# EAGLE schematic registers2-4a (EAGLE 7.5.0)

## Sheet 1 of 2
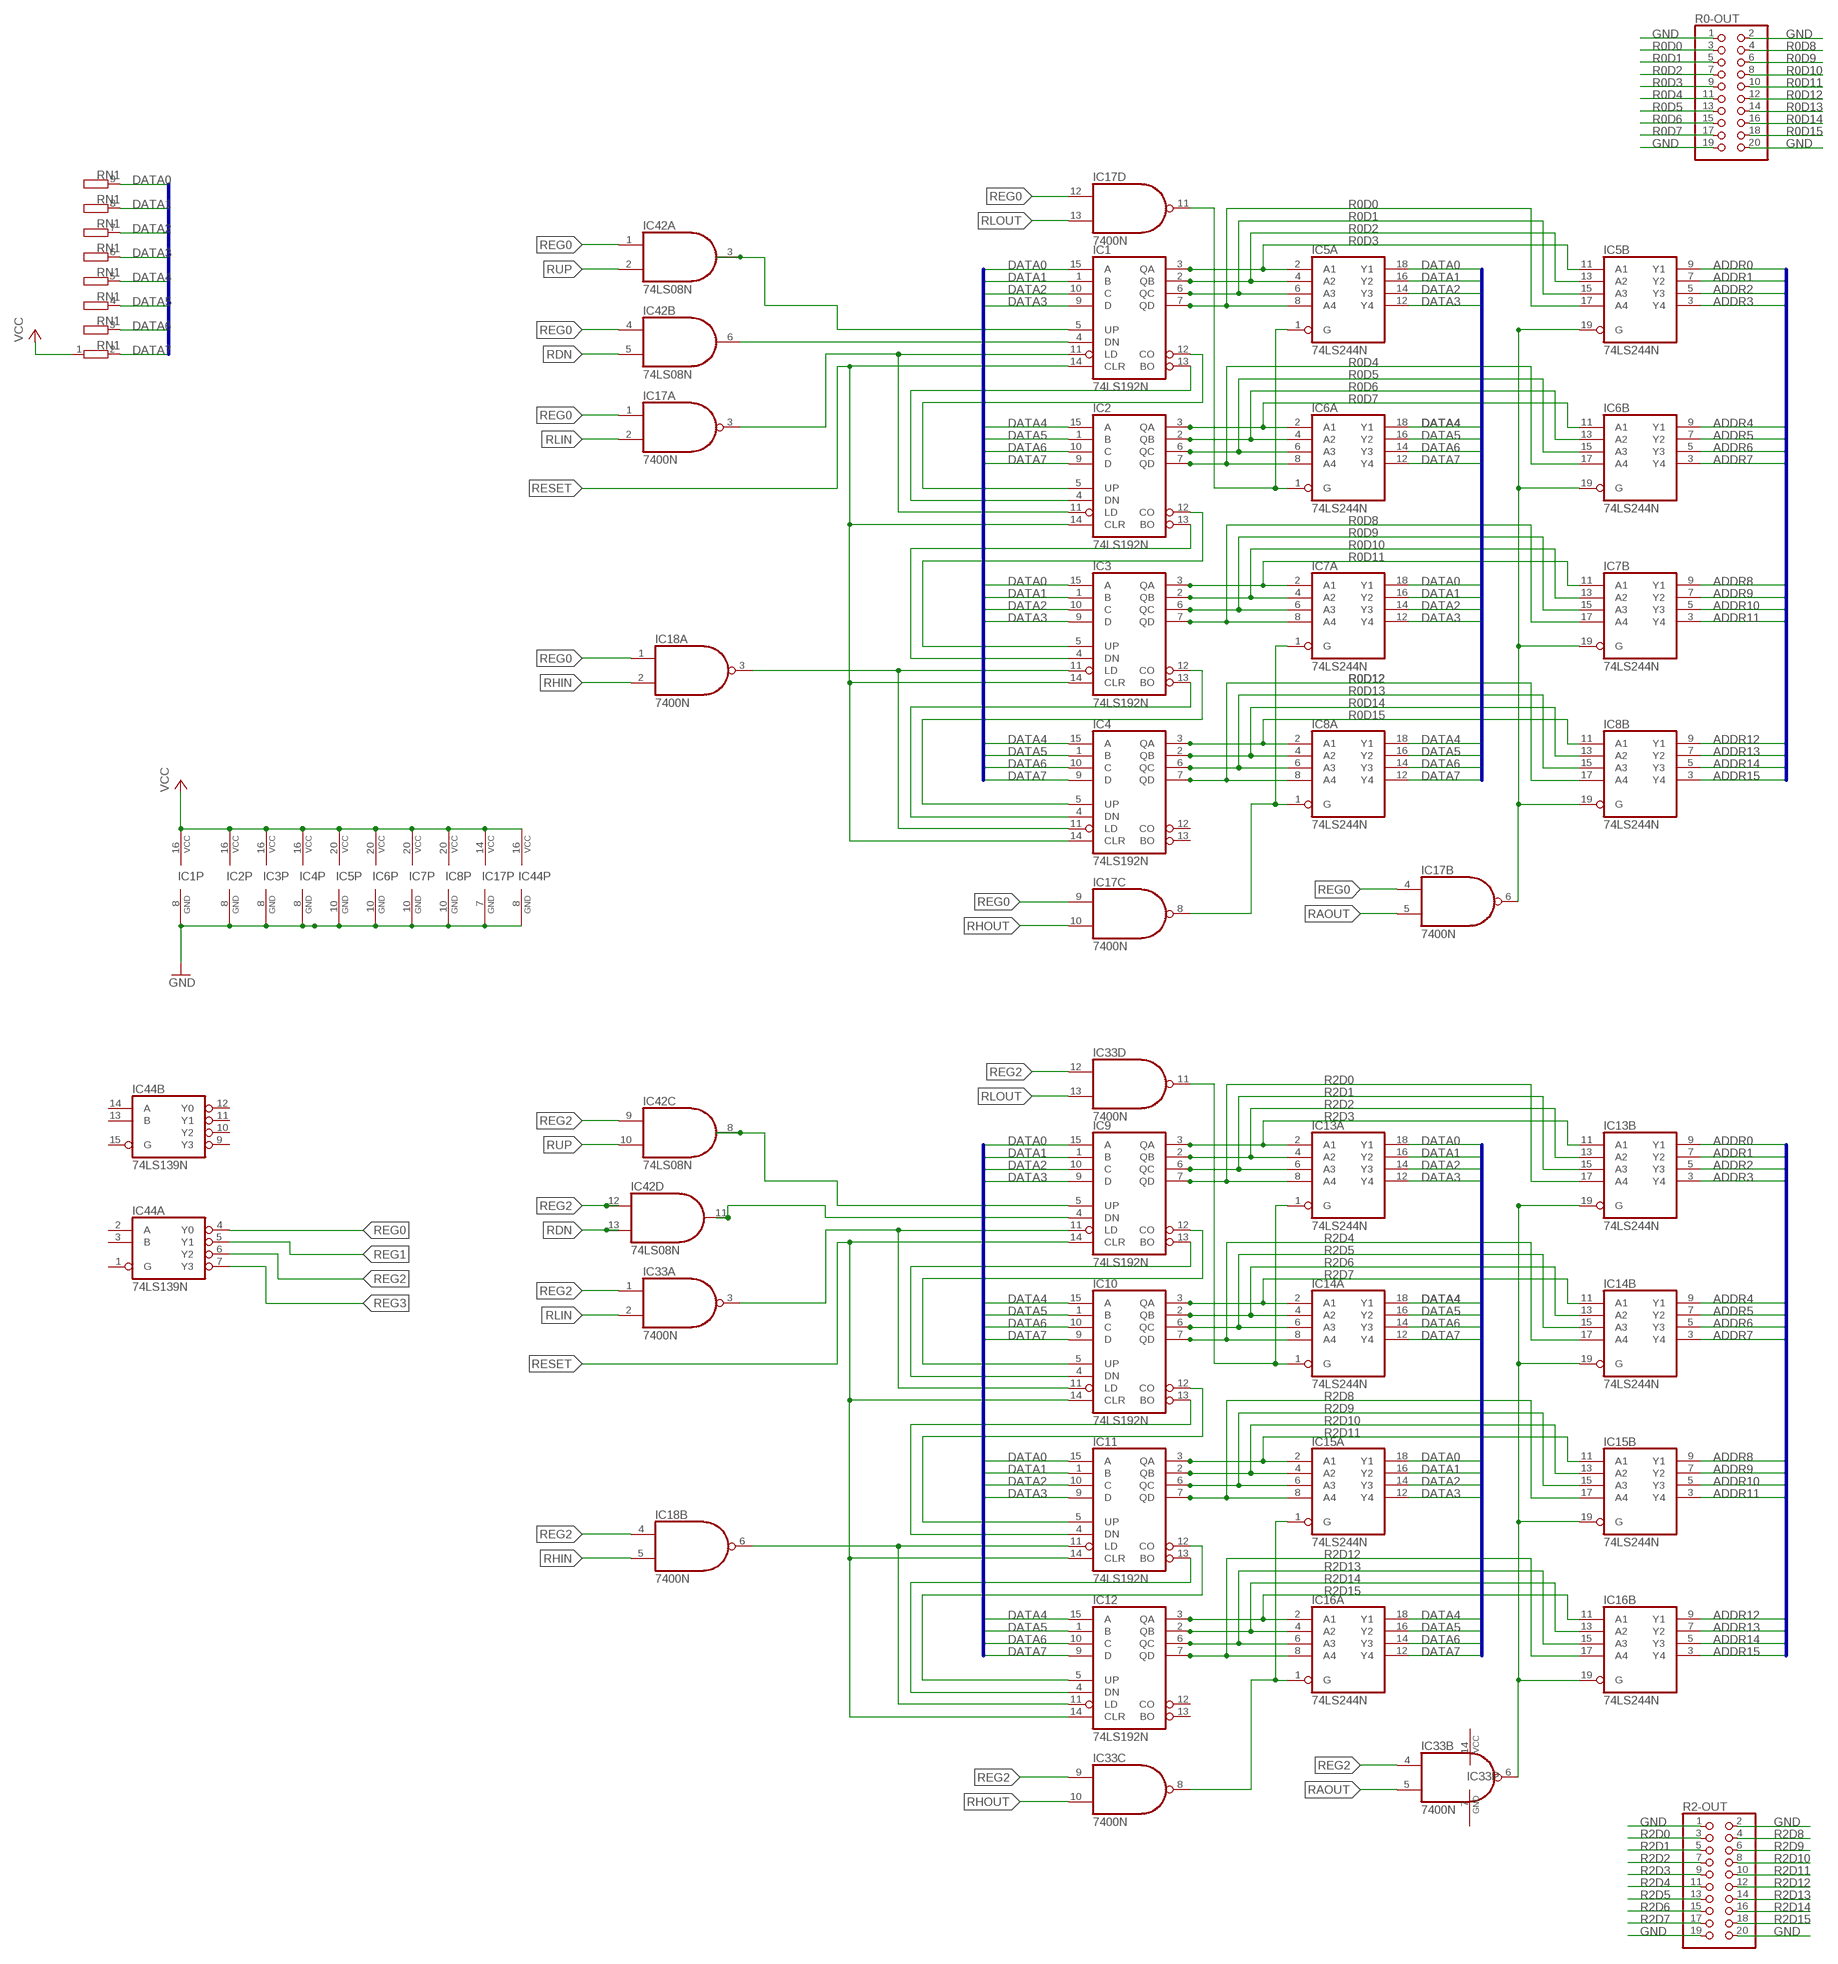
[diagram p0: schematic, sheet 1, part 1 of 2]
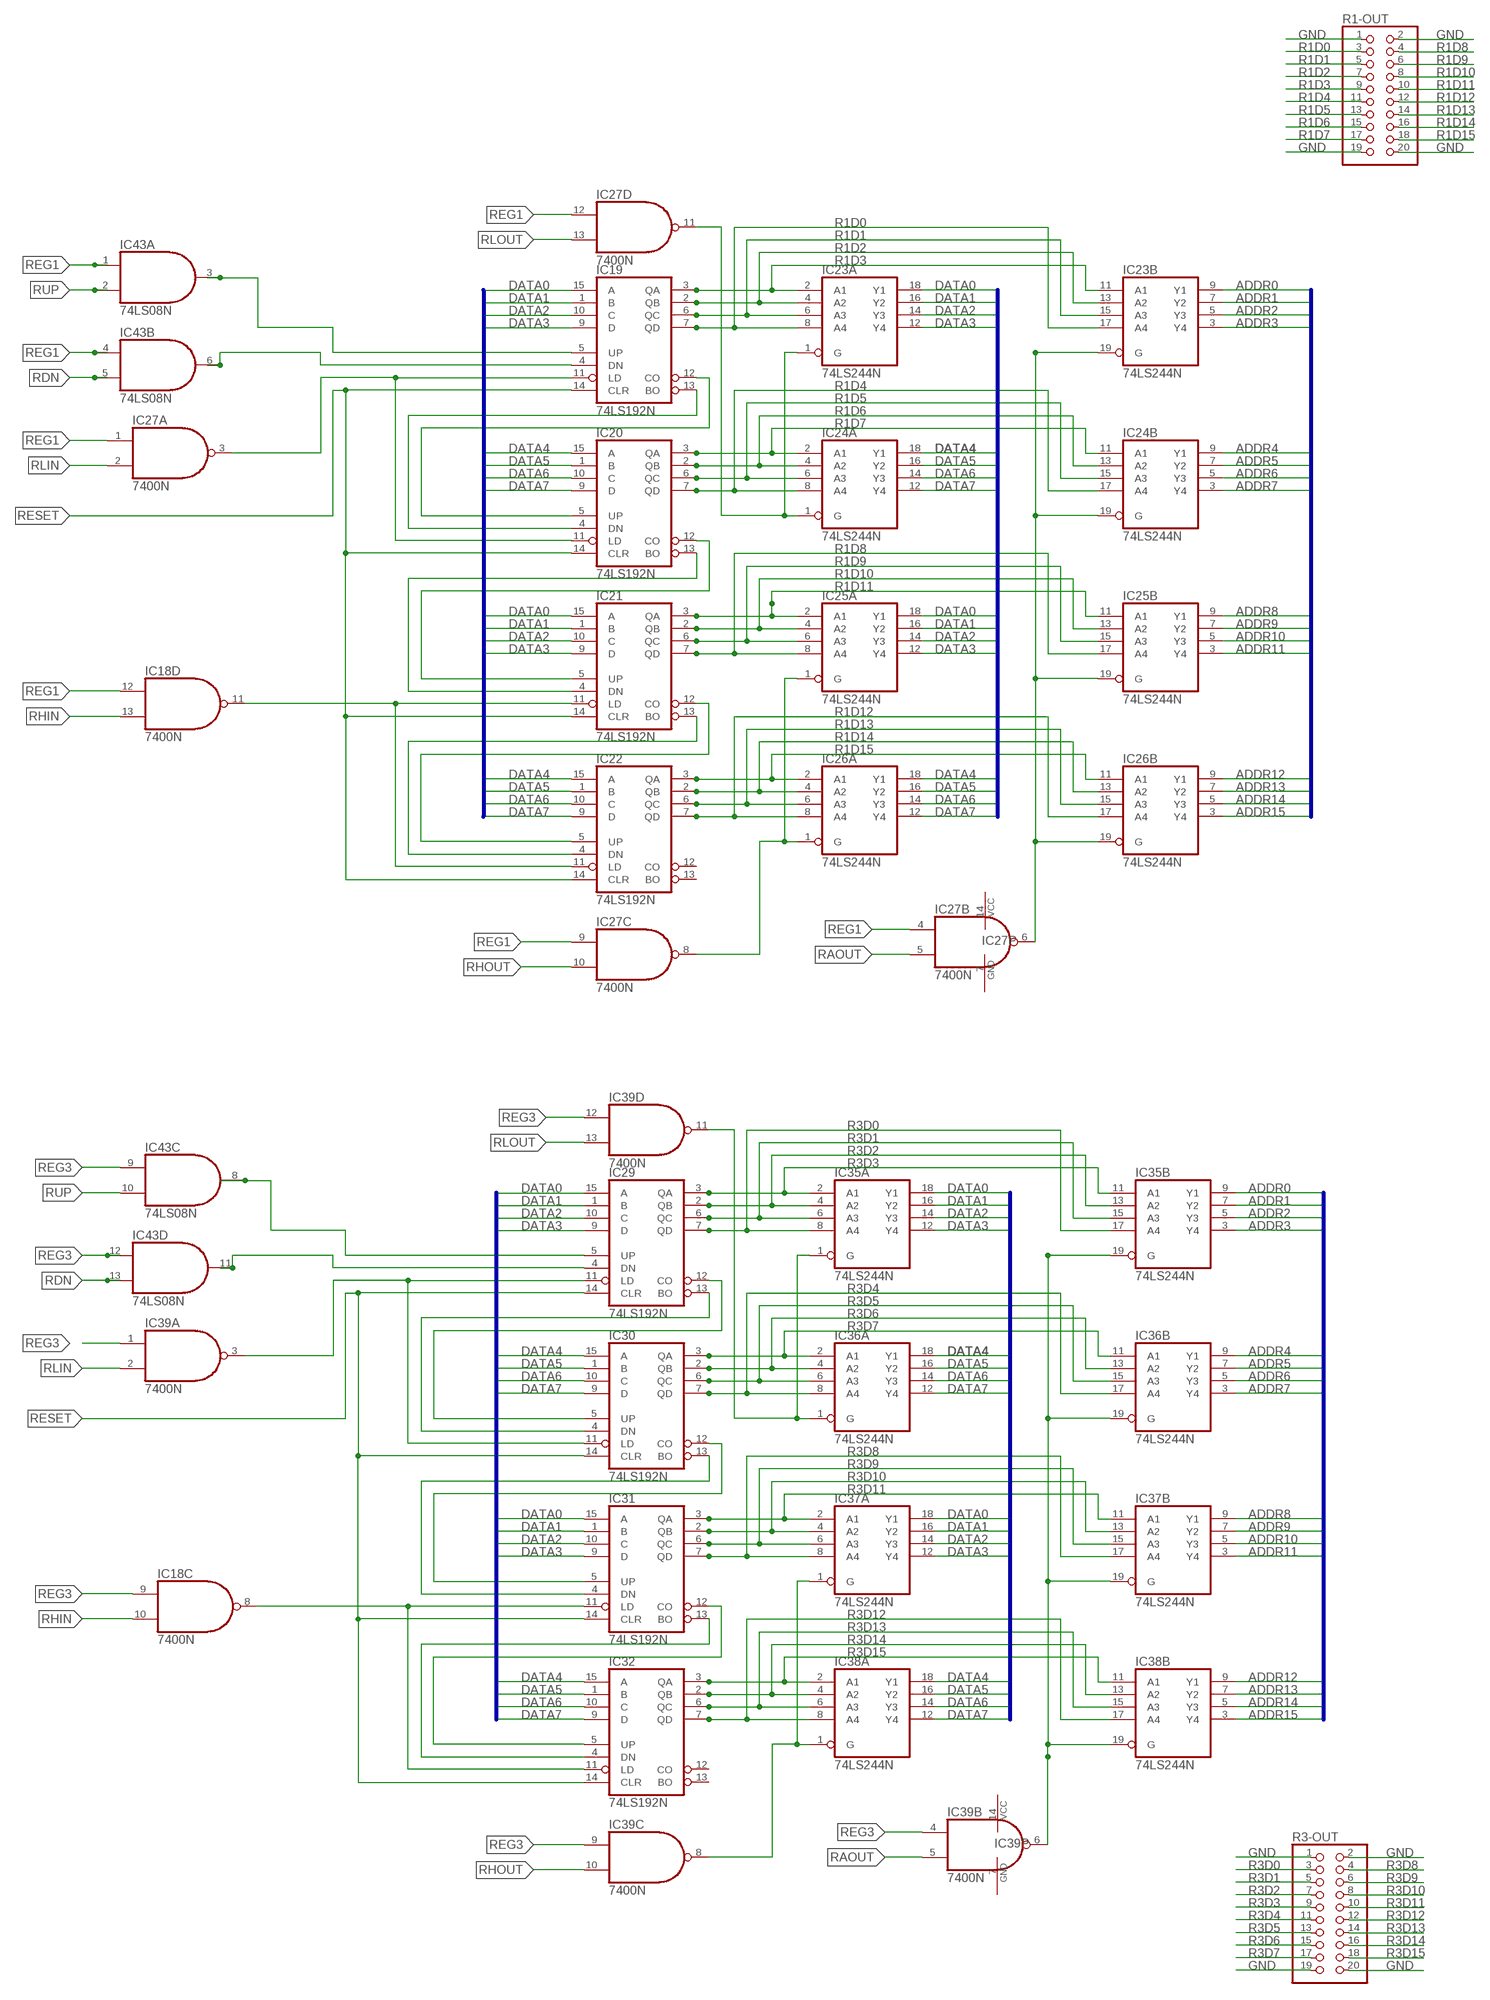
[diagram p1: schematic, sheet 1, part 2 of 2]

### Parts
IC1  74LS192N  [DIL16]
IC2  74LS192N  [DIL16]
IC3  74LS192N  [DIL16]
IC4  74LS192N  [DIL16]
IC5  74LS244N  [DIL20]
IC6  74LS244N  [DIL20]
IC7  74LS244N  [DIL20]
IC8  74LS244N  [DIL20]
IC9  74LS192N  [DIL16]
IC10  74LS192N  [DIL16]
IC11  74LS192N  [DIL16]
IC12  74LS192N  [DIL16]
IC13  74LS244N  [DIL20]
IC14  74LS244N  [DIL20]
IC15  74LS244N  [DIL20]
IC16  74LS244N  [DIL20]
IC17  7400N  [DIL14]
IC18  7400N  [DIL14]
IC19  74LS192N  [DIL16]
IC20  74LS192N  [DIL16]
IC21  74LS192N  [DIL16]
IC22  74LS192N  [DIL16]
IC23  74LS244N  [DIL20]
IC24  74LS244N  [DIL20]
IC25  74LS244N  [DIL20]
IC26  74LS244N  [DIL20]
IC27  7400N  [DIL14]
IC29  74LS192N  [DIL16]
IC30  74LS192N  [DIL16]
IC31  74LS192N  [DIL16]
IC32  74LS192N  [DIL16]
IC33  7400N  [DIL14]
IC35  74LS244N  [DIL20]
IC36  74LS244N  [DIL20]
IC37  74LS244N  [DIL20]
IC38  74LS244N  [DIL20]
IC39  7400N  [DIL14]
IC42  74LS08N  [DIL14]
IC43  74LS08N  [DIL14]
IC44  74LS139N  [DIL16]
R0-OUT  PINHD-2X10  [2X10]
R1-OUT  PINHD-2X10  [2X10]
R2-OUT  PINHD-2X10  [2X10]
R3-OUT  PINHD-2X10  [2X10]
RN1  GE08RP  [SIL9]

### Nets
ADDR0: IC5.9(B:Y1) IC13.9(B:Y1) IC23.9(B:Y1) IC35.9(B:Y1) ; also sheet 2
ADDR1: IC5.7(B:Y2) IC13.7(B:Y2) IC23.7(B:Y2) IC35.7(B:Y2) ; also sheet 2
ADDR2: IC5.5(B:Y3) IC13.5(B:Y3) IC23.5(B:Y3) IC35.5(B:Y3) ; also sheet 2
ADDR3: IC5.3(B:Y4) IC13.3(B:Y4) IC23.3(B:Y4) IC35.3(B:Y4) ; also sheet 2
ADDR4: IC6.9(B:Y1) IC14.9(B:Y1) IC24.9(B:Y1) IC36.9(B:Y1) ; also sheet 2
ADDR5: IC6.7(B:Y2) IC14.7(B:Y2) IC24.7(B:Y2) IC36.7(B:Y2) ; also sheet 2
ADDR6: IC6.5(B:Y3) IC14.5(B:Y3) IC24.5(B:Y3) IC36.5(B:Y3) ; also sheet 2
ADDR7: IC6.3(B:Y4) IC14.3(B:Y4) IC24.3(B:Y4) IC36.3(B:Y4) ; also sheet 2
ADDR8: IC7.9(B:Y1) IC15.9(B:Y1) IC25.9(B:Y1) IC37.9(B:Y1) ; also sheet 2
ADDR9: IC7.7(B:Y2) IC15.7(B:Y2) IC25.7(B:Y2) IC37.7(B:Y2) ; also sheet 2
ADDR10: IC7.5(B:Y3) IC15.5(B:Y3) IC25.5(B:Y3) IC37.5(B:Y3) ; also sheet 2
ADDR11: IC7.3(B:Y4) IC15.3(B:Y4) IC25.3(B:Y4) IC37.3(B:Y4) ; also sheet 2
ADDR12: IC8.9(B:Y1) IC16.9(B:Y1) IC26.9(B:Y1) IC38.9(B:Y1) ; also sheet 2
ADDR13: IC8.7(B:Y2) IC16.7(B:Y2) IC26.7(B:Y2) IC38.7(B:Y2) ; also sheet 2
ADDR14: IC8.5(B:Y3) IC16.5(B:Y3) IC26.5(B:Y3) IC38.5(B:Y3) ; also sheet 2
ADDR15: IC8.3(B:Y4) IC16.3(B:Y4) IC26.3(B:Y4) IC38.3(B:Y4) ; also sheet 2
DATA0: IC1.15(A) IC3.15(A) IC5.18(A:Y1) IC7.18(A:Y1) IC9.15(A) IC11.15(A) IC13.18(A:Y1) IC15.18(A:Y1) IC19.15(A) IC21.15(A) IC23.18(A:Y1) IC25.18(A:Y1) IC29.15(A) IC31.15(A) IC35.18(A:Y1) IC37.18(A:Y1) RN1.9 ; also sheet 2
DATA1: IC1.1(B) IC3.1(B) IC5.16(A:Y2) IC7.16(A:Y2) IC9.1(B) IC11.1(B) IC13.16(A:Y2) IC15.16(A:Y2) IC19.1(B) IC21.1(B) IC23.16(A:Y2) IC25.16(A:Y2) IC29.1(B) IC31.1(B) IC35.16(A:Y2) IC37.16(A:Y2) RN1.8 ; also sheet 2
DATA2: IC1.10(C) IC3.10(C) IC5.14(A:Y3) IC7.14(A:Y3) IC9.10(C) IC11.10(C) IC13.14(A:Y3) IC15.14(A:Y3) IC19.10(C) IC21.10(C) IC23.14(A:Y3) IC25.14(A:Y3) IC29.10(C) IC31.10(C) IC35.14(A:Y3) IC37.14(A:Y3) RN1.7 ; also sheet 2
DATA3: IC1.9(D) IC3.9(D) IC5.12(A:Y4) IC7.12(A:Y4) IC9.9(D) IC11.9(D) IC13.12(A:Y4) IC15.12(A:Y4) IC19.9(D) IC21.9(D) IC23.12(A:Y4) IC25.12(A:Y4) IC29.9(D) IC31.9(D) IC35.12(A:Y4) IC37.12(A:Y4) RN1.6 ; also sheet 2
DATA4: IC2.15(A) IC4.15(A) IC6.18(A:Y1) IC8.18(A:Y1) IC10.15(A) IC12.15(A) IC14.18(A:Y1) IC16.18(A:Y1) IC20.15(A) IC22.15(A) IC24.18(A:Y1) IC26.18(A:Y1) IC30.15(A) IC32.15(A) IC36.18(A:Y1) IC38.18(A:Y1) RN1.5 ; also sheet 2
DATA5: IC2.1(B) IC4.1(B) IC6.16(A:Y2) IC8.16(A:Y2) IC10.1(B) IC12.1(B) IC14.16(A:Y2) IC16.16(A:Y2) IC20.1(B) IC22.1(B) IC24.16(A:Y2) IC26.16(A:Y2) IC30.1(B) IC32.1(B) IC36.16(A:Y2) IC38.16(A:Y2) RN1.4 ; also sheet 2
DATA6: IC2.10(C) IC4.10(C) IC6.14(A:Y3) IC8.14(A:Y3) IC10.10(C) IC12.10(C) IC14.14(A:Y3) IC16.14(A:Y3) IC20.10(C) IC22.10(C) IC24.14(A:Y3) IC26.14(A:Y3) IC30.10(C) IC32.10(C) IC36.14(A:Y3) IC38.14(A:Y3) RN1.3 ; also sheet 2
DATA7: IC2.9(D) IC4.9(D) IC6.12(A:Y4) IC8.12(A:Y4) IC10.9(D) IC12.9(D) IC14.12(A:Y4) IC16.12(A:Y4) IC20.9(D) IC22.9(D) IC24.12(A:Y4) IC26.12(A:Y4) IC30.9(D) IC32.9(D) IC36.12(A:Y4) IC38.12(A:Y4) RN1.2 ; also sheet 2
GND: IC1.8(GND) IC2.8(GND) IC3.8(GND) IC4.8(GND) IC5.10(P:GND) IC6.10(P:GND) IC7.10(P:GND) IC8.10(P:GND) IC17.7(P:GND) IC44.8(P:GND) R0-OUT.1 R0-OUT.2 R0-OUT.19 R0-OUT.20 R1-OUT.1 R1-OUT.2 R1-OUT.19 R1-OUT.20 R2-OUT.1 R2-OUT.2 R2-OUT.19 R2-OUT.20 R3-OUT.1 R3-OUT.2 R3-OUT.19 R3-OUT.20 ; also sheet 2
N$1: IC1.13(BO) IC2.4(DN)
N$2: IC1.12(CO) IC2.5(UP)
N$3: IC2.13(BO) IC3.4(DN)
N$4: IC2.12(CO) IC3.5(UP)
N$5: IC3.13(BO) IC4.4(DN)
N$6: IC3.12(CO) IC4.5(UP)
N$7: IC1.11(LD) IC2.11(LD) IC17.3(A:O)
N$8: IC1.5(UP) IC42.3(A:O)
N$9: IC1.4(DN) IC42.6(B:O)
N$26: IC5.19(B:G) IC6.19(B:G) IC7.19(B:G) IC8.19(B:G) IC17.6(B:O)
N$27: IC5.1(A:G) IC6.1(A:G) IC17.11(D:O)
N$28: IC7.1(A:G) IC8.1(A:G) IC17.8(C:O)
N$29: IC3.11(LD) IC4.11(LD) IC18.3(A:O)
N$30: IC9.13(BO) IC10.4(DN)
N$31: IC9.12(CO) IC10.5(UP)
N$32: IC10.13(BO) IC11.4(DN)
N$33: IC10.12(CO) IC11.5(UP)
N$34: IC11.13(BO) IC12.4(DN)
N$35: IC11.12(CO) IC12.5(UP)
N$36: IC9.11(LD) IC10.11(LD) IC33.3(A:O)
N$37: IC9.5(UP) IC42.8(C:O)
N$38: IC9.4(DN) IC42.11(D:O)
N$55: IC13.19(B:G) IC14.19(B:G) IC15.19(B:G) IC16.19(B:G) IC33.6(B:O)
N$56: IC13.1(A:G) IC14.1(A:G) IC33.11(D:O)
N$57: IC15.1(A:G) IC16.1(A:G) IC33.8(C:O)
N$58: IC19.13(BO) IC20.4(DN)
N$59: IC19.12(CO) IC20.5(UP)
N$60: IC20.13(BO) IC21.4(DN)
N$61: IC20.12(CO) IC21.5(UP)
N$62: IC21.13(BO) IC22.4(DN)
N$63: IC21.12(CO) IC22.5(UP)
N$64: IC19.11(LD) IC20.11(LD) IC27.3(A:O)
N$65: IC19.5(UP) IC43.3(A:O)
N$66: IC19.4(DN) IC43.6(B:O)
N$83: IC23.19(B:G) IC24.19(B:G) IC25.19(B:G) IC26.19(B:G) IC27.6(B:O)
N$84: IC23.1(A:G) IC24.1(A:G) IC27.11(D:O)
N$85: IC25.1(A:G) IC26.1(A:G) IC27.8(C:O)
N$86: IC18.11(D:O) IC21.11(LD) IC22.11(LD)
N$87: IC29.13(BO) IC30.4(DN)
N$88: IC29.12(CO) IC30.5(UP)
N$89: IC30.13(BO) IC31.4(DN)
N$90: IC30.12(CO) IC31.5(UP)
N$91: IC31.13(BO) IC32.4(DN)
N$92: IC31.12(CO) IC32.5(UP)
N$93: IC29.11(LD) IC30.11(LD) IC39.3(A:O)
N$94: IC29.5(UP) IC43.8(C:O)
N$95: IC29.4(DN) IC43.11(D:O)
N$112: IC35.19(B:G) IC36.19(B:G) IC37.19(B:G) IC38.19(B:G) IC39.6(B:O)
N$113: IC35.1(A:G) IC36.1(A:G) IC39.11(D:O)
N$114: IC37.1(A:G) IC38.1(A:G) IC39.8(C:O)
N$115: IC18.8(C:O) IC31.11(LD) IC32.11(LD)
N$117: IC11.11(LD) IC12.11(LD) IC18.6(B:O)
R0D0: IC1.7(QD) IC5.8(A:A4) IC5.17(B:A4) R0-OUT.3
R0D1: IC1.6(QC) IC5.6(A:A3) IC5.15(B:A3) R0-OUT.5
R0D2: IC1.2(QB) IC5.4(A:A2) IC5.13(B:A2) R0-OUT.7
R0D3: IC1.3(QA) IC5.2(A:A1) IC5.11(B:A1) R0-OUT.9
R0D4: IC2.7(QD) IC6.8(A:A4) IC6.17(B:A4) R0-OUT.11
R0D5: IC2.6(QC) IC6.6(A:A3) IC6.15(B:A3) R0-OUT.13
R0D6: IC2.2(QB) IC6.4(A:A2) IC6.13(B:A2) R0-OUT.15
R0D7: IC2.3(QA) IC6.2(A:A1) IC6.11(B:A1) R0-OUT.17
R0D8: IC3.7(QD) IC7.8(A:A4) IC7.17(B:A4) R0-OUT.4
R0D9: IC3.6(QC) IC7.6(A:A3) IC7.15(B:A3) R0-OUT.6
R0D10: IC3.2(QB) IC7.4(A:A2) IC7.13(B:A2) R0-OUT.8
R0D11: IC3.3(QA) IC7.2(A:A1) IC7.11(B:A1) R0-OUT.10
R0D12: IC4.7(QD) IC8.8(A:A4) IC8.17(B:A4) R0-OUT.12
R0D13: IC4.6(QC) IC8.6(A:A3) IC8.15(B:A3) R0-OUT.14
R0D14: IC4.2(QB) IC8.4(A:A2) IC8.13(B:A2) R0-OUT.16
R0D15: IC4.3(QA) IC8.2(A:A1) IC8.11(B:A1) R0-OUT.18
R1D0: IC19.7(QD) IC23.8(A:A4) IC23.17(B:A4) R1-OUT.3
R1D1: IC19.6(QC) IC23.6(A:A3) IC23.15(B:A3) R1-OUT.5
R1D2: IC19.2(QB) IC23.4(A:A2) IC23.13(B:A2) R1-OUT.7
R1D3: IC19.3(QA) IC23.2(A:A1) IC23.11(B:A1) R1-OUT.9
R1D4: IC20.7(QD) IC24.8(A:A4) IC24.17(B:A4) R1-OUT.11
R1D5: IC20.6(QC) IC24.6(A:A3) IC24.15(B:A3) R1-OUT.13
R1D6: IC20.2(QB) IC24.4(A:A2) IC24.13(B:A2) R1-OUT.15
R1D7: IC20.3(QA) IC24.2(A:A1) IC24.11(B:A1) R1-OUT.17
R1D8: IC21.7(QD) IC25.8(A:A4) IC25.17(B:A4) R1-OUT.4
R1D9: IC21.6(QC) IC25.6(A:A3) IC25.15(B:A3) R1-OUT.6
R1D10: IC21.2(QB) IC25.4(A:A2) IC25.13(B:A2) R1-OUT.8
R1D11: IC21.3(QA) IC25.2(A:A1) IC25.11(B:A1) R1-OUT.10
R1D12: IC22.7(QD) IC26.8(A:A4) IC26.17(B:A4) R1-OUT.12
R1D13: IC22.6(QC) IC26.6(A:A3) IC26.15(B:A3) R1-OUT.14
R1D14: IC22.2(QB) IC26.4(A:A2) IC26.13(B:A2) R1-OUT.16
R1D15: IC22.3(QA) IC26.2(A:A1) IC26.11(B:A1) R1-OUT.18
R2D0: IC9.7(QD) IC13.8(A:A4) IC13.17(B:A4) R2-OUT.3
R2D1: IC9.6(QC) IC13.6(A:A3) IC13.15(B:A3) R2-OUT.5
R2D2: IC9.2(QB) IC13.4(A:A2) IC13.13(B:A2) R2-OUT.7
R2D3: IC9.3(QA) IC13.2(A:A1) IC13.11(B:A1) R2-OUT.9
R2D4: IC10.7(QD) IC14.8(A:A4) IC14.17(B:A4) R2-OUT.11
R2D5: IC10.6(QC) IC14.6(A:A3) IC14.15(B:A3) R2-OUT.13
R2D6: IC10.2(QB) IC14.4(A:A2) IC14.13(B:A2) R2-OUT.15
R2D7: IC10.3(QA) IC14.2(A:A1) IC14.11(B:A1) R2-OUT.17
R2D8: IC11.7(QD) IC15.8(A:A4) IC15.17(B:A4) R2-OUT.4
R2D9: IC11.6(QC) IC15.6(A:A3) IC15.15(B:A3) R2-OUT.6
R2D10: IC11.2(QB) IC15.4(A:A2) IC15.13(B:A2) R2-OUT.8
R2D11: IC11.3(QA) IC15.2(A:A1) IC15.11(B:A1) R2-OUT.10
R2D12: IC12.7(QD) IC16.8(A:A4) IC16.17(B:A4) R2-OUT.12
R2D13: IC12.6(QC) IC16.6(A:A3) IC16.15(B:A3) R2-OUT.14
R2D14: IC12.2(QB) IC16.4(A:A2) IC16.13(B:A2) R2-OUT.16
R2D15: IC12.3(QA) IC16.2(A:A1) IC16.11(B:A1) R2-OUT.18
R3D0: IC29.7(QD) IC35.8(A:A4) IC35.17(B:A4) R3-OUT.3
R3D1: IC29.6(QC) IC35.6(A:A3) IC35.15(B:A3) R3-OUT.5
R3D2: IC29.2(QB) IC35.4(A:A2) IC35.13(B:A2) R3-OUT.7
R3D3: IC29.3(QA) IC35.2(A:A1) IC35.11(B:A1) R3-OUT.9
R3D4: IC30.7(QD) IC36.8(A:A4) IC36.17(B:A4) R3-OUT.11
R3D5: IC30.6(QC) IC36.6(A:A3) IC36.15(B:A3) R3-OUT.13
R3D6: IC30.2(QB) IC36.4(A:A2) IC36.13(B:A2) R3-OUT.15
R3D7: IC30.3(QA) IC36.2(A:A1) IC36.11(B:A1) R3-OUT.17
R3D8: IC31.7(QD) IC37.8(A:A4) IC37.17(B:A4) R3-OUT.4
R3D9: IC31.6(QC) IC37.6(A:A3) IC37.15(B:A3) R3-OUT.6
R3D10: IC31.2(QB) IC37.4(A:A2) IC37.13(B:A2) R3-OUT.8
R3D11: IC31.3(QA) IC37.2(A:A1) IC37.11(B:A1) R3-OUT.10
R3D12: IC32.7(QD) IC38.8(A:A4) IC38.17(B:A4) R3-OUT.12
R3D13: IC32.6(QC) IC38.6(A:A3) IC38.15(B:A3) R3-OUT.14
R3D14: IC32.2(QB) IC38.4(A:A2) IC38.13(B:A2) R3-OUT.16
R3D15: IC32.3(QA) IC38.2(A:A1) IC38.11(B:A1) R3-OUT.18
RAOUT: IC17.5(B:I1) IC27.5(B:I1) IC33.5(B:I1) IC39.5(B:I1) ; also sheet 2
RDN: IC42.5(B:I1) IC42.13(D:I1) IC43.5(B:I1) IC43.13(D:I1) ; also sheet 2
REG0: IC17.1(A:I0) IC17.4(B:I0) IC17.9(C:I0) IC17.12(D:I0) IC18.1(A:I0) IC42.1(A:I0) IC42.4(B:I0) IC44.4(A:Y0)
REG1: IC18.12(D:I0) IC27.1(A:I0) IC27.4(B:I0) IC27.9(C:I0) IC27.12(D:I0) IC43.1(A:I0) IC43.4(B:I0) IC44.5(A:Y1)
REG2: IC18.4(B:I0) IC33.1(A:I0) IC33.4(B:I0) IC33.9(C:I0) IC33.12(D:I0) IC42.9(C:I0) IC42.12(D:I0) IC44.6(A:Y2)
REG3: IC18.9(C:I0) IC39.1(A:I0) IC39.4(B:I0) IC39.9(C:I0) IC39.12(D:I0) IC43.9(C:I0) IC43.12(D:I0) IC44.7(A:Y3)
RESET: IC1.14(CLR) IC2.14(CLR) IC3.14(CLR) IC4.14(CLR) IC9.14(CLR) IC10.14(CLR) IC11.14(CLR) IC12.14(CLR) IC19.14(CLR) IC20.14(CLR) IC21.14(CLR) IC22.14(CLR) IC29.14(CLR) IC30.14(CLR) IC31.14(CLR) IC32.14(CLR) ; also sheet 2
RHIN: IC18.2(A:I1) IC18.5(B:I1) IC18.10(C:I1) IC18.13(D:I1) ; also sheet 2
RHOUT: IC17.10(C:I1) IC27.10(C:I1) IC33.10(C:I1) IC39.10(C:I1) ; also sheet 2
RLIN: IC17.2(A:I1) IC27.2(A:I1) IC33.2(A:I1) IC39.2(A:I1) ; also sheet 2
RLOUT: IC17.13(D:I1) IC27.13(D:I1) IC33.13(D:I1) IC39.13(D:I1) ; also sheet 2
RUP: IC42.2(A:I1) IC42.10(C:I1) IC43.2(A:I1) IC43.10(C:I1) ; also sheet 2
VCC: IC1.16(VCC) IC2.16(VCC) IC3.16(VCC) IC4.16(VCC) IC5.20(P:VCC) IC6.20(P:VCC) IC7.20(P:VCC) IC8.20(P:VCC) IC17.14(P:VCC) IC44.16(P:VCC) RN1.1 ; also sheet 2
Unconnected: IC4.12(CO) IC4.13(BO) IC12.12(CO) IC12.13(BO) IC22.12(CO) IC22.13(BO) IC32.12(CO) IC32.13(BO) IC44.1(A:G) IC44.2(A:A) IC44.3(A:B) IC44.9(B:Y3) IC44.10(B:Y2) IC44.11(B:Y1) IC44.12(B:Y0) IC44.13(B:B) IC44.14(B:A) IC44.15(B:G)

### Buses
ADDR[0..15]
DATA[0..7]

## Sheet 2 of 2
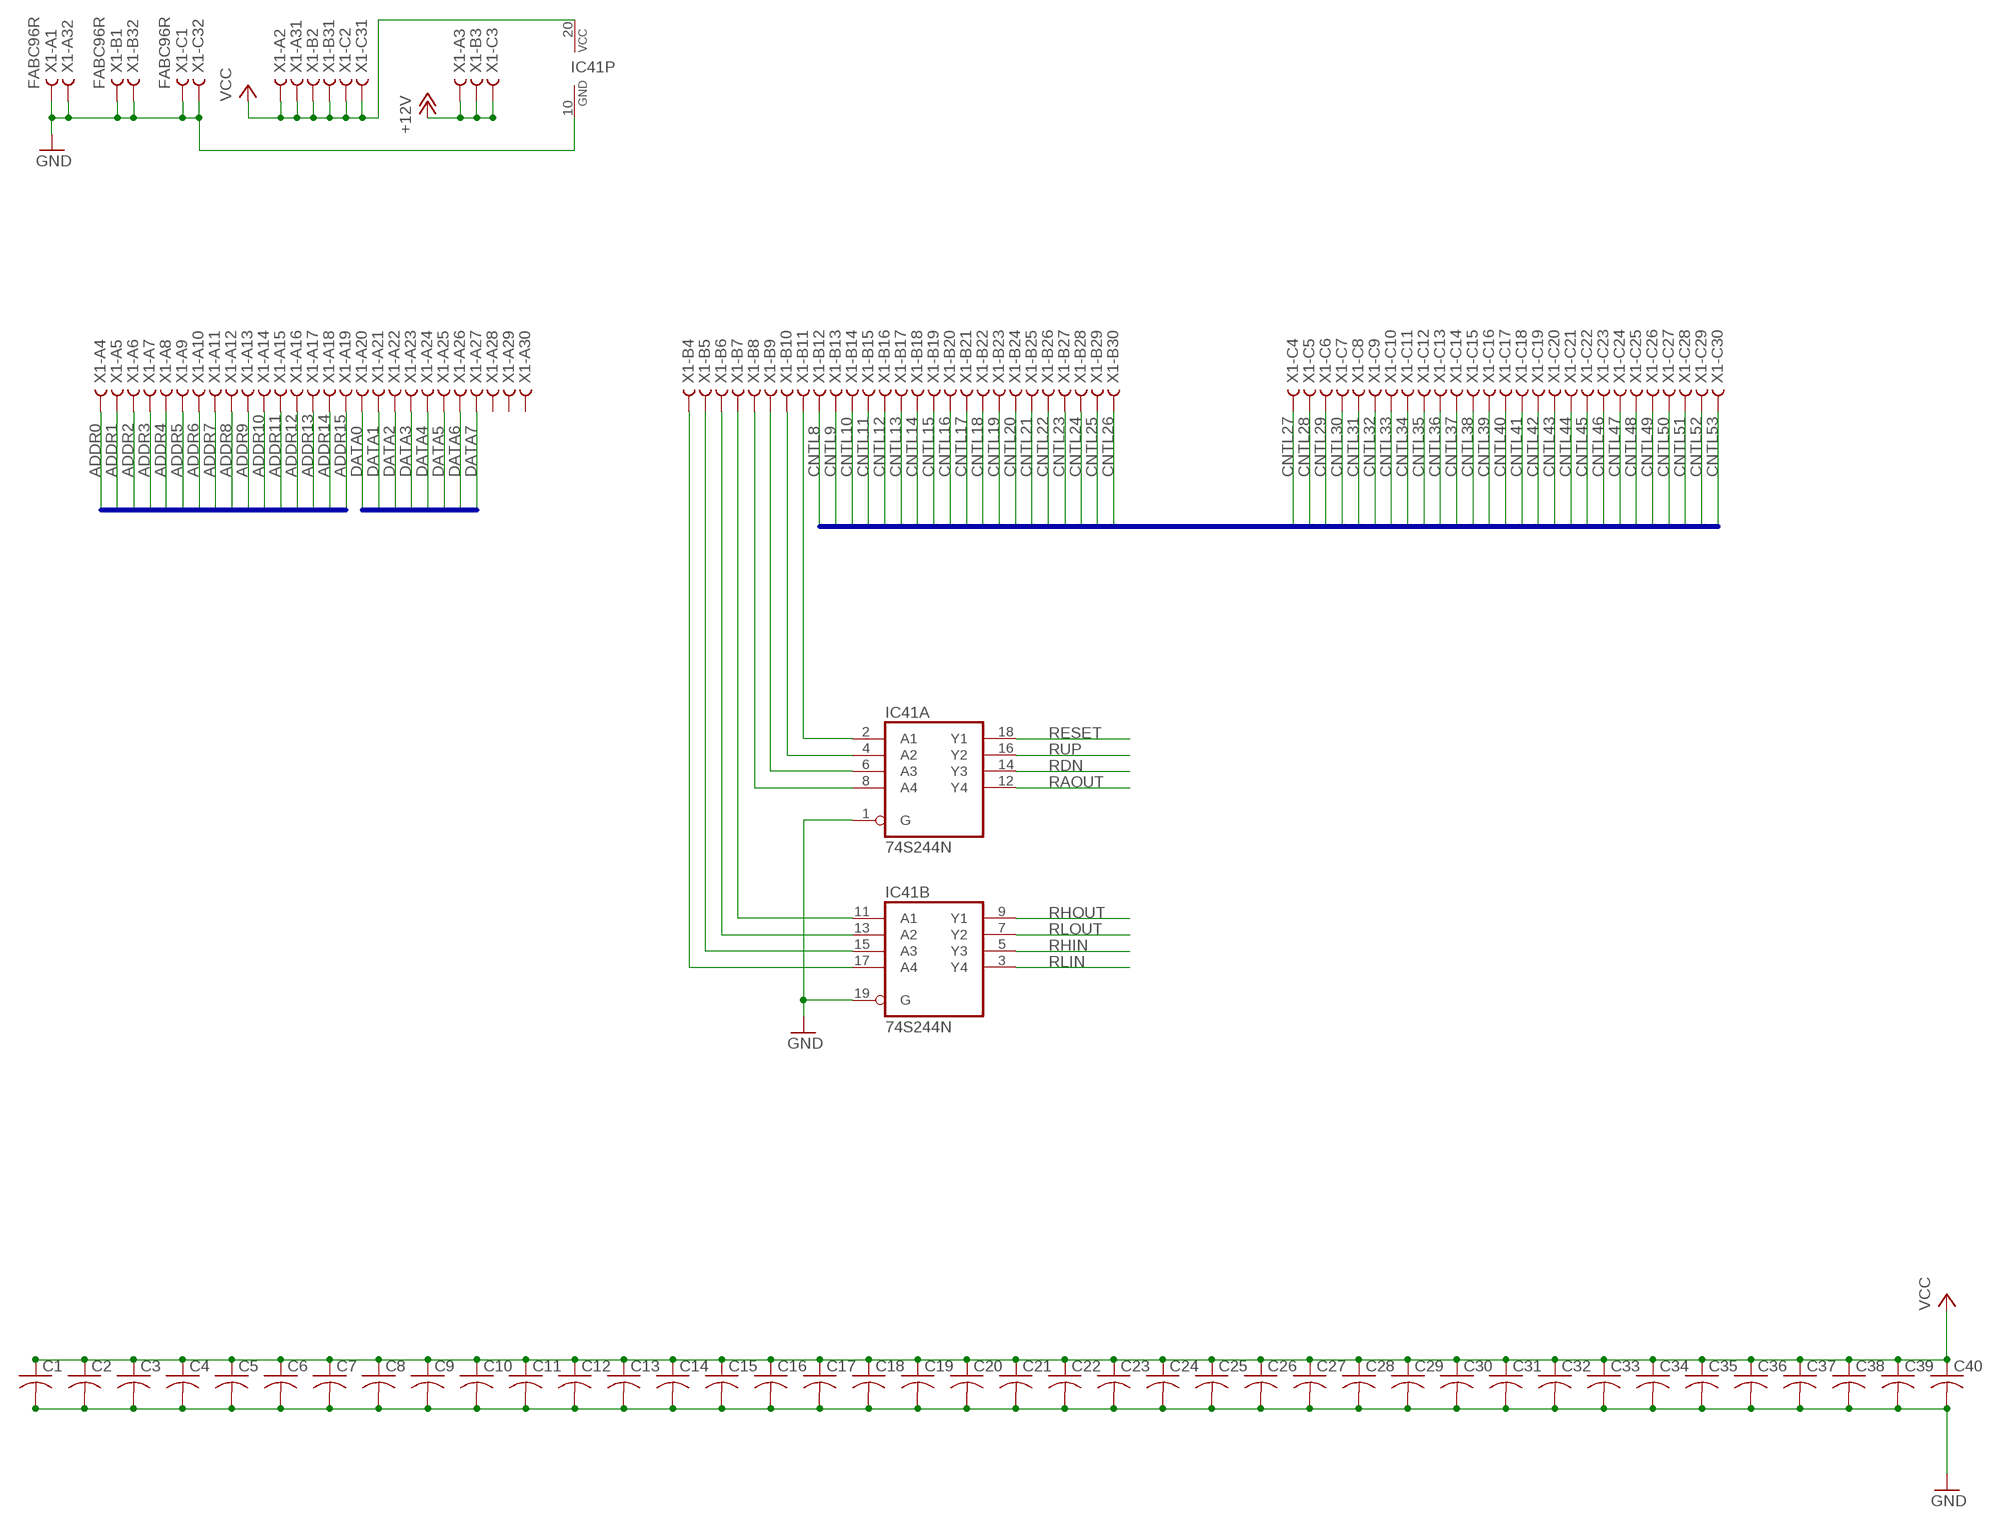
[diagram p2: schematic, sheet 2]

### Parts
C1  C-US025-040X050  [C025-040X050]
C2  C-US025-040X050  [C025-040X050]
C3  C-US025-040X050  [C025-040X050]
C4  C-US025-040X050  [C025-040X050]
C5  C-US025-040X050  [C025-040X050]
C6  C-US025-040X050  [C025-040X050]
C7  C-US025-040X050  [C025-040X050]
C8  C-US025-040X050  [C025-040X050]
C9  C-US025-040X050  [C025-040X050]
C10  C-US025-040X050  [C025-040X050]
C11  C-US025-040X050  [C025-040X050]
C12  C-US025-040X050  [C025-040X050]
C13  C-US025-040X050  [C025-040X050]
C14  C-US025-040X050  [C025-040X050]
C15  C-US025-040X050  [C025-040X050]
C16  C-US025-040X050  [C025-040X050]
C17  C-US025-040X050  [C025-040X050]
C18  C-US025-040X050  [C025-040X050]
C19  C-US025-040X050  [C025-040X050]
C20  C-US025-040X050  [C025-040X050]
C21  C-US025-040X050  [C025-040X050]
C22  C-US025-040X050  [C025-040X050]
C23  C-US025-040X050  [C025-040X050]
C24  C-US025-040X050  [C025-040X050]
C25  C-US025-040X050  [C025-040X050]
C26  C-US025-040X050  [C025-040X050]
C27  C-US025-040X050  [C025-040X050]
C28  C-US025-040X050  [C025-040X050]
C29  C-US025-040X050  [C025-040X050]
C30  C-US025-040X050  [C025-040X050]
C31  C-US025-040X050  [C025-040X050]
C32  C-US025-040X050  [C025-040X050]
C33  C-US025-040X050  [C025-040X050]
C34  C-US025-040X050  [C025-040X050]
C35  C-US025-040X050  [C025-040X050]
C36  C-US025-040X050  [C025-040X050]
C37  C-US025-040X050  [C025-040X050]
C38  C-US025-040X050  [C025-040X050]
C39  C-US025-040X050  [C025-040X050]
C40  C-US025-040X050  [C025-040X050]
IC41  74S244N  [DIL20]
X1  FABC96R  [FABC96R]

### Nets
+12V: X1.A3 X1.B3 X1.C3
ADDR0: X1.A4 ; also sheet 1
ADDR1: X1.A5 ; also sheet 1
ADDR2: X1.A6 ; also sheet 1
ADDR3: X1.A7 ; also sheet 1
ADDR4: X1.A8 ; also sheet 1
ADDR5: X1.A9 ; also sheet 1
ADDR6: X1.A10 ; also sheet 1
ADDR7: X1.A11 ; also sheet 1
ADDR8: X1.A12 ; also sheet 1
ADDR9: X1.A13 ; also sheet 1
ADDR10: X1.A14 ; also sheet 1
ADDR11: X1.A15 ; also sheet 1
ADDR12: X1.A16 ; also sheet 1
ADDR13: X1.A17 ; also sheet 1
ADDR14: X1.A18 ; also sheet 1
ADDR15: X1.A19 ; also sheet 1
CNTL8: X1.B12
CNTL9: X1.B13
CNTL10: X1.B14
CNTL11: X1.B15
CNTL12: X1.B16
CNTL13: X1.B17
CNTL14: X1.B18
CNTL15: X1.B19
CNTL16: X1.B20
CNTL17: X1.B21
CNTL18: X1.B22
CNTL19: X1.B23
CNTL20: X1.B24
CNTL21: X1.B25
CNTL22: X1.B26
CNTL23: X1.B27
CNTL24: X1.B28
CNTL25: X1.B29
CNTL26: X1.B30
CNTL27: X1.C4
CNTL28: X1.C5
CNTL29: X1.C6
CNTL30: X1.C7
CNTL31: X1.C8
CNTL32: X1.C9
CNTL33: X1.C10
CNTL34: X1.C11
CNTL35: X1.C12
CNTL36: X1.C13
CNTL37: X1.C14
CNTL38: X1.C15
CNTL39: X1.C16
CNTL40: X1.C17
CNTL41: X1.C18
CNTL42: X1.C19
CNTL43: X1.C20
CNTL44: X1.C21
CNTL45: X1.C22
CNTL46: X1.C23
CNTL47: X1.C24
CNTL48: X1.C25
CNTL49: X1.C26
CNTL50: X1.C27
CNTL51: X1.C28
CNTL52: X1.C29
CNTL53: X1.C30
DATA0: X1.A20 ; also sheet 1
DATA1: X1.A21 ; also sheet 1
DATA2: X1.A22 ; also sheet 1
DATA3: X1.A23 ; also sheet 1
DATA4: X1.A24 ; also sheet 1
DATA5: X1.A25 ; also sheet 1
DATA6: X1.A26 ; also sheet 1
DATA7: X1.A27 ; also sheet 1
GND: C1.2 C2.2 C3.2 C4.2 C5.2 C6.2 C7.2 C8.2 C9.2 C10.2 C11.2 C12.2 C13.2 C14.2 C15.2 C16.2 C17.2 C18.2 C19.2 C20.2 C21.2 C22.2 C23.2 C24.2 C25.2 C26.2 C27.2 C28.2 C29.2 C30.2 C31.2 C32.2 C33.2 C34.2 C35.2 C36.2 C37.2 C38.2 C39.2 C40.2 IC41.1(A:G) IC41.10(P:GND) IC41.19(B:G) X1.A1 X1.A32 X1.B1 X1.B32 X1.C1 X1.C32 ; also sheet 1
N$116: IC41.17(B:A4) X1.B4
N$118: IC41.15(B:A3) X1.B5
N$119: IC41.13(B:A2) X1.B6
N$120: IC41.11(B:A1) X1.B7
N$121: IC41.8(A:A4) X1.B8
N$122: IC41.6(A:A3) X1.B9
N$123: IC41.4(A:A2) X1.B10
N$124: IC41.2(A:A1) X1.B11
RAOUT: IC41.12(A:Y4) ; also sheet 1
RDN: IC41.14(A:Y3) ; also sheet 1
RESET: IC41.18(A:Y1) ; also sheet 1
RHIN: IC41.5(B:Y3) ; also sheet 1
RHOUT: IC41.9(B:Y1) ; also sheet 1
RLIN: IC41.3(B:Y4) ; also sheet 1
RLOUT: IC41.7(B:Y2) ; also sheet 1
RUP: IC41.16(A:Y2) ; also sheet 1
VCC: C1.1 C2.1 C3.1 C4.1 C5.1 C6.1 C7.1 C8.1 C9.1 C10.1 C11.1 C12.1 C13.1 C14.1 C15.1 C16.1 C17.1 C18.1 C19.1 C20.1 C21.1 C22.1 C23.1 C24.1 C25.1 C26.1 C27.1 C28.1 C29.1 C30.1 C31.1 C32.1 C33.1 C34.1 C35.1 C36.1 C37.1 C38.1 C39.1 C40.1 IC41.20(P:VCC) X1.A2 X1.A31 X1.B2 X1.B31 X1.C2 X1.C31 ; also sheet 1
Unconnected: X1.A28 X1.A29 X1.A30

### Buses
ADDR[0..15]
DATA[0..7]
CNTL[0..53]

## Power pins joined to a net without a drawn wire
GND: IC9.8(GND) IC10.8(GND) IC11.8(GND) IC12.8(GND) IC13.10(P:GND) IC14.10(P:GND) IC15.10(P:GND) IC16.10(P:GND) IC18.7(P:GND) IC19.8(GND) IC20.8(GND) IC21.8(GND) IC22.8(GND) IC23.10(P:GND) IC24.10(P:GND) IC25.10(P:GND) IC26.10(P:GND) IC27.7(P:GND) IC29.8(GND) IC30.8(GND) IC31.8(GND) IC32.8(GND) IC33.7(P:GND) IC35.10(P:GND) IC36.10(P:GND) IC37.10(P:GND) IC38.10(P:GND) IC39.7(P:GND) IC42.7(P:GND) IC43.7(P:GND)
VCC: IC9.16(VCC) IC10.16(VCC) IC11.16(VCC) IC12.16(VCC) IC13.20(P:VCC) IC14.20(P:VCC) IC15.20(P:VCC) IC16.20(P:VCC) IC18.14(P:VCC) IC19.16(VCC) IC20.16(VCC) IC21.16(VCC) IC22.16(VCC) IC23.20(P:VCC) IC24.20(P:VCC) IC25.20(P:VCC) IC26.20(P:VCC) IC27.14(P:VCC) IC29.16(VCC) IC30.16(VCC) IC31.16(VCC) IC32.16(VCC) IC33.14(P:VCC) IC35.20(P:VCC) IC36.20(P:VCC) IC37.20(P:VCC) IC38.20(P:VCC) IC39.14(P:VCC) IC42.14(P:VCC) IC43.14(P:VCC)

## Library data of the parts
C1-C40 = rcl:C-US: CAPACITOR, American symbol
IC1-IC4 IC9-IC12 IC19-IC22 IC29-IC32 = 74xx-us:74*192: Synchronous 4-bit UP/DOWN COUNTER
IC5-IC8 IC13-IC16 IC23-IC26 IC35-IC38 = 74xx-us:74*244: Octal BUFFER and LINE DRIVER, 3-state
IC17 IC18 IC27 IC33 IC39 = 74xx-us:74*00: Quad 2-input NAND gate
IC41 = 74xx-eu:74*244: Octal BUFFER and LINE DRIVER, 3-state
IC42 IC43 = 74xx-us:74*08: Quad 2-input AND gate
IC44 = 74xx-us:74*139: Dual 2-line to 4-line DECODER/DEMULTIPLEXER
R0-OUT R1-OUT R2-OUT R3-OUT = pinhead:PINHD-2X10: PIN HEADER
RN1 = resistor-sil:GE08RP: SIL RESISTOR; OC_FARNELL: unknown; OC_NEWARK: unknown
X1 = con-vg:FABC96R: CONNECTOR female, 96 pins, type R, rows ABC, grid 2.54 mm